# Altium schematic sheet Digital_STMG474RE.SchDoc
size A3; SheetNumber: 4; SheetTotal: 4
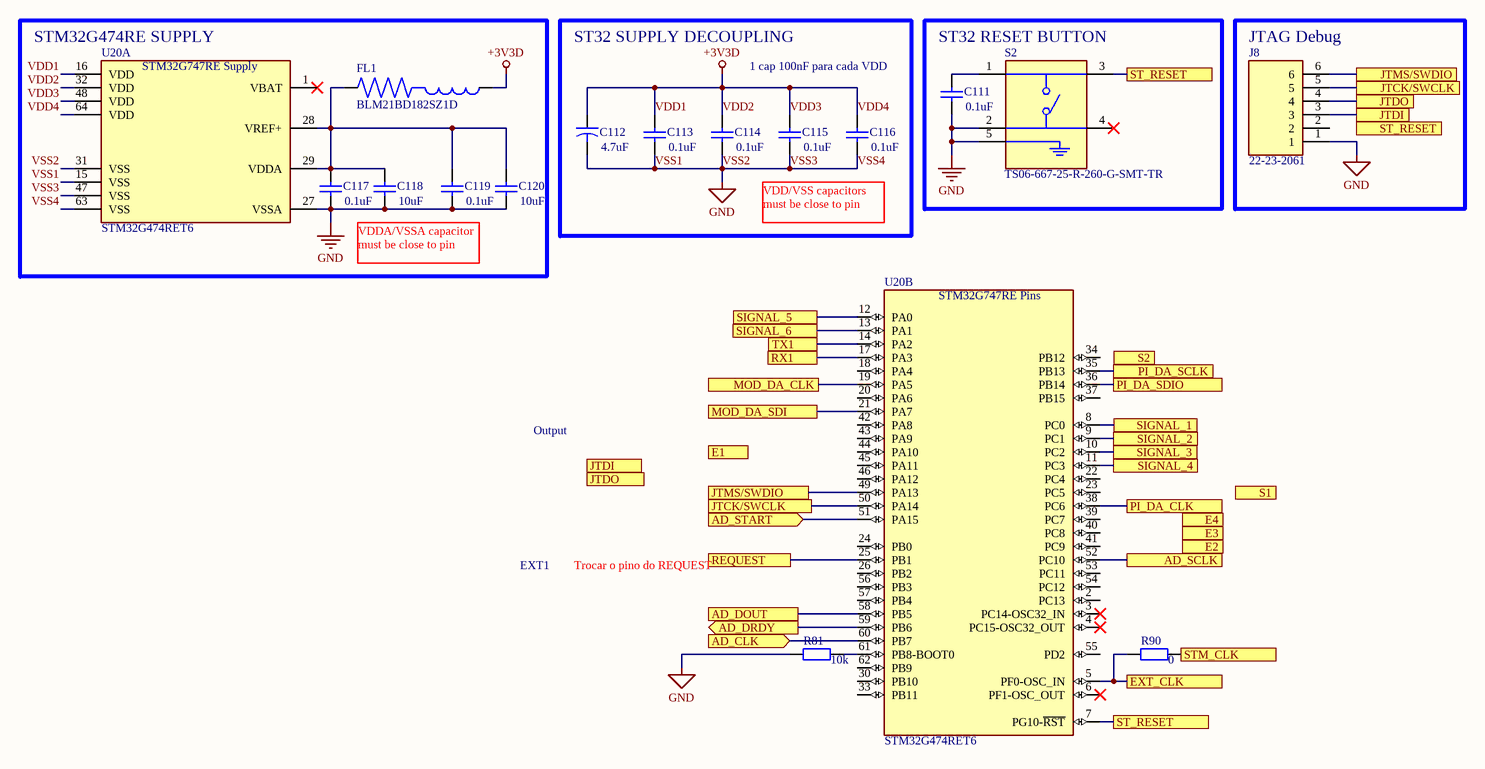
[diagram p0: Digital_STMG474RE.SchDoc]

## Parts
C111  value 0.1uF  [CC_0805]  (hidden comment: Cap)
C112  value 4.7uF  [CC_0805]  (hidden comment: Cap2)
C113  value 0.1uF  [CC_0805]  (hidden comment: Cap)
C114  value 0.1uF  [CC_0805]  (hidden comment: Cap)
C115  value 0.1uF  [CC_0805]  (hidden comment: Cap)
C116  value 0.1uF  [CC_0805]  (hidden comment: Cap)
C117  value 0.1uF  [CC_0805]  (hidden comment: Cap)
C118  value 10uF  [CC_0805]  (hidden comment: Cap)
C119  value 0.1uF  [CC_0805]  (hidden comment: Cap)
C120  value 10uF  [CC_0805]  (hidden comment: Cap)
FL1  BLM21BD182SZ1D  [BLM21BD182SZ1D]
J8  22-23-2061  [22-23-2061]
R81  value 10k  [RR_1220]  (hidden comment: Res2)
R90  value 0  [RR_1220]  (hidden comment: Res2)
S2  TS06-667-25-R-260-G-SMT-TR  [TS06-667-25-R-260-G-SMT-TR]
U20  STM32G474RET6  [STMG474RET6]  (parts A,B of 2)

## Blocks framed on the sheet
STM32G474RE SUPPLY: C117-C120 FL1 U20
ST32 SUPPLY DECOUPLING: C112-C116
ST32 RESET BUTTON: C111 S2
JTAG Debug: J8

## Ports
AD_CLK (in, see Analog_Supply_and_TIA[5C], Digital_Connectors_and_IHM[2A], Digital_Connectors_and_IHM[5A]), AD_DOUT (see Analog_Supply_and_TIA[4C], Digital_Connectors_and_IHM[1A]), AD_DRDY (out, see Analog_Supply_and_TIA[4C], Digital_Connectors_and_IHM[1A]), AD_SCLK (see Analog_Supply_and_TIA[5C], Digital_Connectors_and_IHM[1A]), AD_START (in, see Analog_Supply_and_TIA[3C], Digital_Connectors_and_IHM[1A]), E1, E2, E3, E4, EXT_CLK, JTCK/SWCLK (see Digital_STMG474RE[3B]), JTCK/SWCLK (see Digital_STMG474RE[6A]), JTDI (see Digital_STMG474RE[3B]), JTDI (see Digital_STMG474RE[6A]), JTDO (see Digital_STMG474RE[3B]), JTDO (see Digital_STMG474RE[6A]), JTMS/SWDIO (see Digital_STMG474RE[3B]), JTMS/SWDIO (see Digital_STMG474RE[6A]), MOD_DA_CLK (see Analog_Modulation[5A], Digital_Connectors_and_IHM[1B]), MOD_DA_SDI (see Analog_Modulation[5A], Digital_Connectors_and_IHM[1B]), PI_DA_CLK (see Analog_Modulation[1A], Digital_Connectors_and_IHM[1B]), PI_DA_SCLK (see Analog_Modulation[1A], Digital_Connectors_and_IHM[2B]), PI_DA_SDIO (see Analog_Modulation[1A], Digital_Connectors_and_IHM[2B]), REQUEST, RX1 (see Digital_Connectors_and_IHM[6B]), S1, S2, SIGNAL_1 (see Digital_Connectors_and_IHM[1C], Digital_Connectors_and_IHM[7A]), SIGNAL_2 (see Digital_Connectors_and_IHM[1C], Digital_Connectors_and_IHM[6A]), SIGNAL_3 (see Digital_Connectors_and_IHM[1C], Digital_Connectors_and_IHM[7A]), SIGNAL_4 (see Digital_Connectors_and_IHM[2C], Digital_Connectors_and_IHM[6A]), SIGNAL_5 (see Digital_Connectors_and_IHM[3C], Digital_Connectors_and_IHM[7A]), SIGNAL_6 (see Digital_Connectors_and_IHM[4C], Digital_Connectors_and_IHM[6A]), ST_RESET (see Digital_STMG474RE[5A], Digital_STMG474RE[5B]), ST_RESET (see Digital_STMG474RE[5A], Digital_STMG474RE[6A]), ST_RESET (see Digital_STMG474RE[5B], Digital_STMG474RE[6A]), STM_CLK (see Digital_Connectors_and_IHM[6B]), TX1 (see Digital_Connectors_and_IHM[8B])

## Nets
VDD1: C112.1 C113.2 C114.2 C115.2 C116.2 FL1.1 U20.16(VDD) U20.32(VDD) U20.48(VDD) U20.64(VDD)  [also labelled +3V3D, VDD2, VDD3, VDD4]
VSS1: C111.1 C112.2 C113.1 C114.1 C115.1 C116.1 C117.1 C118.1 C119.1 C120.1 J8.1 R81.1 S2.2 S2.5 U20.15(VSS) U20.27(VSSA) U20.31(VSS) U20.47(VSS) U20.63(VSS)  [also labelled GND, VSS2, VSS3, VSS4]
AD_CLK: U20.60(PB7) ; port AD_CLK
AD_DOUT: U20.58(PB5) ; port AD_DOUT
AD_DRDY: U20.59(PB6) ; port AD_DRDY
AD_SCLK: U20.52(PC10) ; port AD_SCLK
AD_START: U20.51(PA15) ; port AD_START
EXT_CLK: R90.1 U20.5(PF0-OSC_IN) ; port EXT_CLK
JTCK/SWCLK: J8.5 U20.50(PA14) ; port JTCK/SWCLK
JTDI: J8.3 ; port JTDI
JTDO: J8.4 ; port JTDO
JTMS/SWDIO: J8.6 U20.49(PA13) ; port JTMS/SWDIO
MOD_DA_CLK: U20.19(PA5) ; port MOD_DA_CLK
MOD_DA_SDI: U20.21(PA7) ; port MOD_DA_SDI
PI_DA_CLK: U20.38(PC6) ; port PI_DA_CLK
PI_DA_SCLK: U20.35(PB13) ; port PI_DA_SCLK
PI_DA_SDIO: U20.36(PB14) ; port PI_DA_SDIO
REQUEST: U20.25(PB1) ; port REQUEST
RX1: U20.17(PA3) ; port RX1
SIGNAL_1: U20.8(PC0) ; port SIGNAL_1
SIGNAL_2: U20.9(PC1) ; port SIGNAL_2
SIGNAL_3: U20.10(PC2) ; port SIGNAL_3
SIGNAL_4: U20.11(PC3) ; port SIGNAL_4
SIGNAL_5: U20.12(PA0) ; port SIGNAL_5
SIGNAL_6: U20.13(PA1) ; port SIGNAL_6
ST_RESET: S2.3 U20.7(PG10-~{RST}) ; port ST_RESET
STM_CLK: R90.2 ; port STM_CLK
TX1: U20.14(PA2) ; port TX1
NetC111_2: C111.2 S2.1
NetC117_2: C117.2 C118.2 C119.2 C120.2 FL1.2 U20.28(VREF+) U20.29(VDDA)
NetR81_2: R81.2 U20.61(PB8-BOOT0)

Not connected (* = marked no-connect by the designer): J8 2; S2 4*; U20 1(VBAT)* 2(PC13) 3(PC14-OSC32_IN)* 4(PC15-OSC32_OUT)* 6(PF1-OSC_OUT)* 18(PA4) 20(PA6) 22(PC4) 23(PC5) 24(PB0) 26(PB2) 30(PB10) 33(PB11) 34(PB12) 37(PB15) 39(PC7) 40(PC8) 41(PC9) 42(PA8) 43(PA9) 44(PA10) 45(PA11) 46(PA12) 53(PC11) 54(PC12) 55(PD2) 56(PB3) 57(PB4) 62(PB9)

## Notes on the sheet
- 1 cap 100nF para cada VDD
- VDD/VSS capacitors must be close to pin
- VDDA/VSSA capacitor must be close to pin
- Output
- EXT1
- Trocar o pino do REQUEST
- (in symbol STM32G474RET6, part A) STM32G747RE Supply
- (in symbol STM32G474RET6, part B) STM32G747RE Pins

## Library data of the parts
C111 C113-C120 = Cap: Capacitor; Published: 8-Jun-2000; LatestRevisionDate: 17-Jul-2002; LatestRevisionNote: Re-released for DXP Platform.; PackageReference: RAD-0.3; Publisher: Altium Limited; PackageDescription: Radial Cap, Thru-Hole; 2 Leads; 0.3 in Pin Spacing
C112 = Cap2: Capacitor; Published: 23-Sep-2002; PackageReference: CAPR5-4X5; Publisher: Altium Limited; PackageDescription: Capacitor; 2 Leads
J8 = 22-23-2061: 2.54mm,header,KK,vert,Sn,frictn lock,6w Molex KK 254 Series, Series Number 6373, 2.54mm Pitch 6 Way 1 Row Straight PCB Header, Through Hole, Solder Termination; Geometry.Height: 11.05mm; Manufacturer_Name: Molex; Manufacturer_Part_Number: 22-23-2061; Mouser Part Number: 538-22-23-2061; Mouser Price/Stock: https://www.mouser.co.uk/ProductDetail/Molex/22-23-2061?qs=ILqg114nvd6YkpLBwrcQsQ%3D%3D; Arrow Part Number: *; Arrow Price/Stock: *; Datasheet Link: http://www.molex.com/pdm_docs/sd/022232061_sd.pdf
R81 R90 = Res2: Resistor; Published: 8-Jun-2000; LatestRevisionDate: 17-Jul-2002; LatestRevisionNote: Re-released for DXP Platform.; PackageReference: AXIAL-0.4; Publisher: Altium Limited; PackageDescription: Axial Device, Thru-Hole; 2 Leads; 0.4 in Pin Spacing
S2 = TS06-667-25-R-260-G-SMT-TR: 6 x 6.7 mm, 2.5 mm Actuator Height, 260 gf, Red, Surface Mount, SPST, Tactile Switch; MF: Same Sky; SnapEDA_Link: https://www.snapeda.com/parts/TS06-667-25-R-260-G-SMT-TR/Same+Sky/view-part/?ref=snap; Package: None; Value: *; MP: TS06-667-25-R-260-G-SMT-TR; Check_prices: https://www.snapeda.com/parts/TS06-667-25-R-260-G-SMT-TR/Same+Sky/view-part/?ref=eda
U20 = STM32G474RET6: ARMÂ® CortexÂ®-M4F STM32G4 Microcontroller IC 32-Bit Single-Core 170MHz 512KB (512K x 8) FLASH 64-LQFP (10x10); MF: STMicroelectronics; SnapEDA_Link: https://www.snapeda.com/parts/STM32G474RET6/STMicroelectronics/view-part/?ref=snap; Package: LQFP-64 STMicroelectronics; Value: *; MP: STM32G474RET6; Check_prices: https://www.snapeda.com/parts/STM32G474RET6/STMicroelectronics/view-part/?ref=eda
FL1 = BLM21BD182SZ1D: Package: None; Price: None; Value: *; MP: BLM21BD182SZ1D; Availability: Unavailable